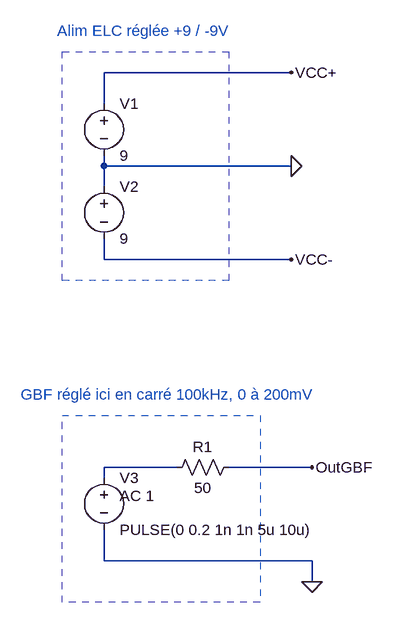
[diagram p0: schematic Draft3.asc]
Draft3.asc, the LTspice schematic file:
Version 4
SHEET 1 880 884
WIRE 224 64 -64 64
WIRE -64 112 -64 64
WIRE -64 208 -64 192
WIRE 224 208 -64 208
WIRE -64 240 -64 208
WIRE -64 352 -64 320
WIRE 224 352 -64 352
WIRE 48 672 -64 672
WIRE 256 672 128 672
WIRE -64 688 -64 672
WIRE -64 816 -64 768
WIRE 256 816 -64 816
WIRE 256 848 256 816
FLAG 224 208 0
FLAG 224 64 VCC+
FLAG 224 352 VCC-
FLAG 256 848 0
FLAG 256 672 OutGBF
SYMBOL voltage -64 96 R0
WINDOW 123 0 0 Left 2
WINDOW 39 0 0 Left 2
SYMATTR InstName V1
SYMATTR Value 9
SYMBOL voltage -64 224 R0
WINDOW 123 0 0 Left 2
WINDOW 39 0 0 Left 2
SYMATTR InstName V2
SYMATTR Value 9
SYMBOL voltage -64 672 R0
WINDOW 123 24 44 Left 2
WINDOW 39 0 0 Left 2
SYMATTR Value2 AC 1
SYMATTR InstName V3
SYMATTR Value PULSE(0 0.2 1n 1n 5u 10u)
SYMBOL res 144 656 R90
WINDOW 0 0 56 VBottom 2
WINDOW 3 32 56 VTop 2
SYMATTR InstName R1
SYMATTR Value 50
TEXT -136 0 Left 2 ;Alim ELC réglée +9 / -9V
TEXT -192 560 Left 2 ;GBF réglé ici en carré 100kHz, 0 à 200mV
RECTANGLE Normal 128 384 -128 32 2
RECTANGLE Normal 176 880 -128 592 2

The netlist it stands for:
* Draft3.asc
V1 VCC+ 0 9
V2 0 VCC- 9
V3 N001 0 PULSE(0 0.2 1n 1n 5u 10u) AC 1
R1 OutGBF N001 50
* Alim ELC réglée +9 / -9V
* GBF réglé ici en carré 100kHz, 0 à 200mV
.backanno
.end